# Altium schematic sheet SD Card Interface.SchDoc
size A4; Organization: TESLA Motors, INC; Address1: 3500 Deer Creek Road; Address2: Palo Alto, CA; Address4: U.S.A.; SheetNumber: 15; SheetTotal: 21
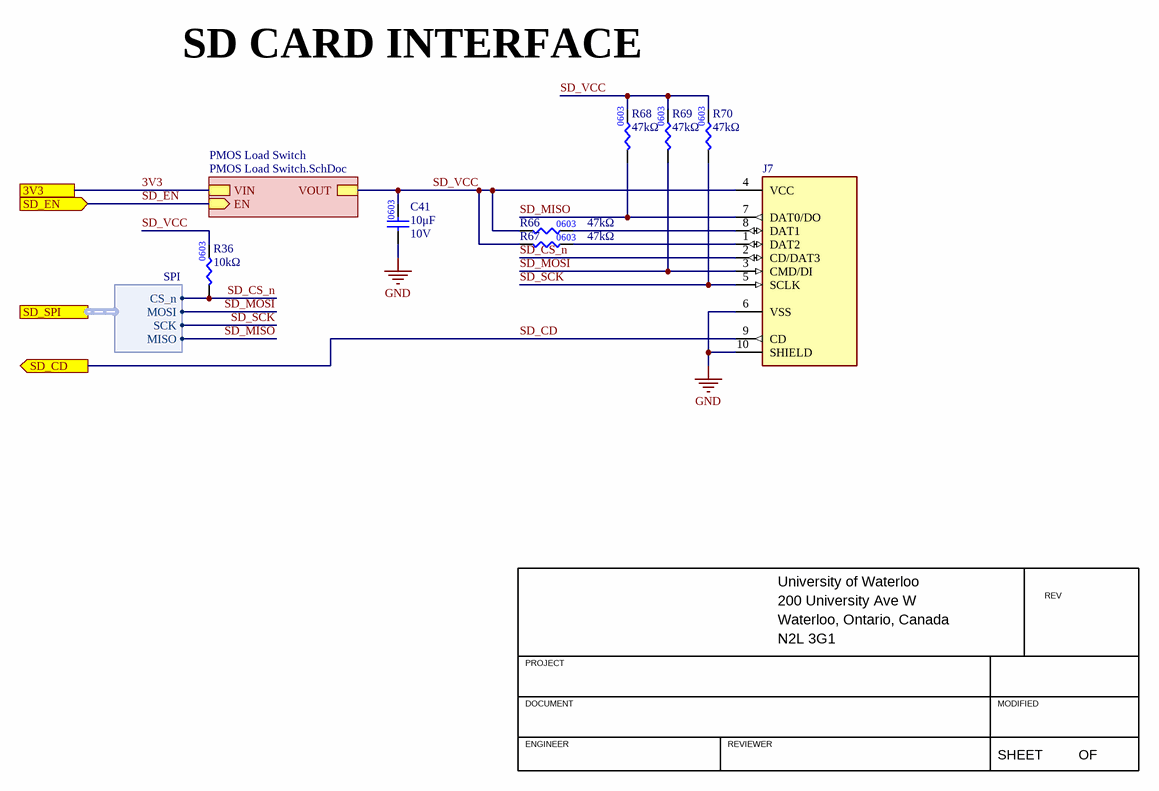
[diagram p0: SD Card Interface.SchDoc]

## Parts
C41  value 10μF  Voltage Rating: 10V  [CAP0603]  (hidden comment: CAP_10uF_10V_0603)
J7  CON_MICROSD_MOLEX  [MOLEX-5033981892]  (value not drawn)
R36  value 10kΩ  [RES0603]  (hidden comment: RES_10kΩ_0603_1%)
R66  value 47kΩ  [RES0603]  (hidden comment: RES_47kΩ_0603_1%)
R67  value 47kΩ  [RES0603]  (hidden comment: RES_47kΩ_0603_1%)
R68  value 47kΩ  [RES0603]  (hidden comment: RES_47kΩ_0603_1%)
R69  value 47kΩ  [RES0603]  (hidden comment: RES_47kΩ_0603_1%)
R70  value 47kΩ  [RES0603]  (hidden comment: RES_47kΩ_0603_1%)

## Sub-sheets
PMOS Load Switch = PMOS Load Switch.SchDoc: VIN, VOUT, EN (in)

## Ports
3V3, SD_CD (out), SD_EN (in), SD_SPI (harness SPI)

## Harnesses
SPI: CS_n, MOSI, MISO, SCK

## Nets
GND: C41.1 J7.6(VSS) J7.10(SHIELD)
3V3: port 3V3, sheet PMOS Load Switch/VIN
SD_CD: J7.9(CD) ; port SD_CD
SD_CS_n: J7.2(CD/DAT3) R36.1 ; port SD_SPI.CS_n
SD_EN: port SD_EN, sheet PMOS Load Switch/EN
SD_MISO: J7.7(DAT0/DO) R68.1 ; port SD_SPI.MISO
SD_MOSI: J7.3(CMD/DI) R69.1 ; port SD_SPI.MOSI
SD_SCK: J7.5(SCLK) R70.1 ; port SD_SPI.SCK
SD_VCC: C41.2 J7.4(VCC) R36.2 R66.1 R67.1 R68.2 R69.2 R70.2 ; sheet PMOS Load Switch/VOUT
NetJ7_1: J7.1(DAT2) R67.2
NetJ7_8: J7.8(DAT1) R66.2

## Notes on the sheet
- SD CARD INTERFACE
- University of Waterloo
- 200 University Ave W
- REV
- PROJECT
- Waterloo, Ontario, Canada
- N2L 3G1
- DOCUMENT
- ENGINEER
- REVIEWER
- MODIFIED
- SHEET
- OF
- (in symbol CAP_10uF_10V_0603) 0603

## Library data of the parts
C41 = CAP_10uF_10V_0603: CAP CER 10UF 10V X5R 0603; Manufacturer Part Number 1: CC0603MRX5R6BB106; Manufacturer 1: Yageo; Supplier Part Number 1: 311-1817-1-ND; Supplier 1: Digi-Key; Dielectric: X5R
J7 = CON_MICROSD_MOLEX: CONN MICRO SD CARD R/A SMD; Manufacturer 1: Molex; Manufacturer Part Number 1: 5033981892; Supplier 1: Digi-Key; Package/Footprint: SMD; Supplier Part Number 1: WM11190CT-ND
R36 = RES_10kΩ_0603_1%: RES 10K OHM 1% 1/8W 0603; Manufacturer 1: Stackpole Electronics Inc; Manufacturer Part Number 1: RNCP0603FTD10K0; Supplier Part Number 1: RNCP0603FTD10K0CT-ND; Supplier 1: Digi-Key; Mounting Type: SMD; Package: 0603
R66-R70 = RES_47kΩ_0603_1%: RES 47K OHM 1% 1/10W 0603; Manufacturer 1: YAGEO; Manufacturer Part Number 1: RC0603FR-0747KL; Mounting Type: SMD; Package: 0603; Supplier 1: DigiKey; Supplier Part Number 1: 311-4.70KHRCT-ND